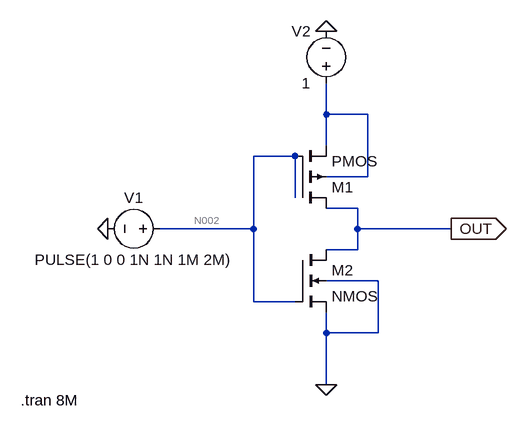
[diagram p0: schematic NOT.asc]
NOT.asc, the LTspice schematic file:
Version 4
SHEET 1 880 680
WIRE 208 16 208 -32
WIRE 272 16 208 16
WIRE 208 64 208 16
WIRE 160 80 96 80
WIRE 272 112 272 16
WIRE 272 112 208 112
WIRE 160 144 160 80
WIRE 256 160 208 160
WIRE 96 192 96 80
WIRE 96 192 -48 192
WIRE 256 192 256 160
WIRE 400 192 256 192
WIRE 256 224 256 192
WIRE 256 224 208 224
WIRE 288 272 208 272
WIRE 96 304 96 192
WIRE 160 304 96 304
WIRE 208 352 208 320
WIRE 288 352 288 272
WIRE 288 352 208 352
WIRE 208 432 208 352
FLAG 400 192 OUT
IOPIN 400 192 Out
FLAG -128 192 0
FLAG 208 -112 0
FLAG 208 432 0
SYMBOL pmos4 160 160 M180
SYMATTR InstName M1
SYMBOL nmos4 160 224 R0
SYMATTR InstName M2
SYMBOL voltage -32 192 R90
WINDOW 0 -32 56 VBottom 2
WINDOW 3 32 56 VTop 2
WINDOW 123 0 0 Left 0
WINDOW 39 0 0 Left 0
SYMATTR InstName V1
SYMATTR Value PULSE(1 0 0 1N 1N 1M 2M)
SYMBOL voltage 208 -16 R180
WINDOW 0 24 96 Left 2
WINDOW 3 24 16 Left 2
WINDOW 123 0 0 Left 0
WINDOW 39 0 0 Left 0
SYMATTR InstName V2
SYMATTR Value 1
TEXT -262 456 Left 2 !.tran 8M

The netlist it stands for:
* NOT.asc
M1 OUT N002 N001 N001 PMOS
M2 OUT N002 0 0 NMOS
V1 N002 0 PULSE(1 0 0 1N 1N 1M 2M)
V2 N001 0 1
.model NMOS NMOS
.model PMOS PMOS
.lib standard.mos
.tran 8M
.backanno
.end

* Results of the author's LTspice run, read from the files saved beside the schematic
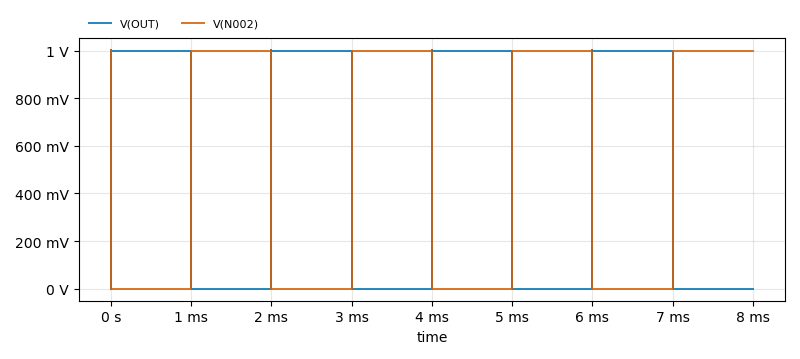
[diagram p1: Transient Analysis of NOT.asc, plotted from the saved traces]
* Transient Analysis, 1 run:
*   V(OUT): min 0 V, max 1.001 V, average 500 mV, rms 707.1 mV, last 100.5 nV
*   V(N002): min 0 V, max 1 V, average 500 mV, rms 707.1 mV, last 1 V